# Altium schematic sheet Sh_Outputs_Analog.SchDoc
size A3
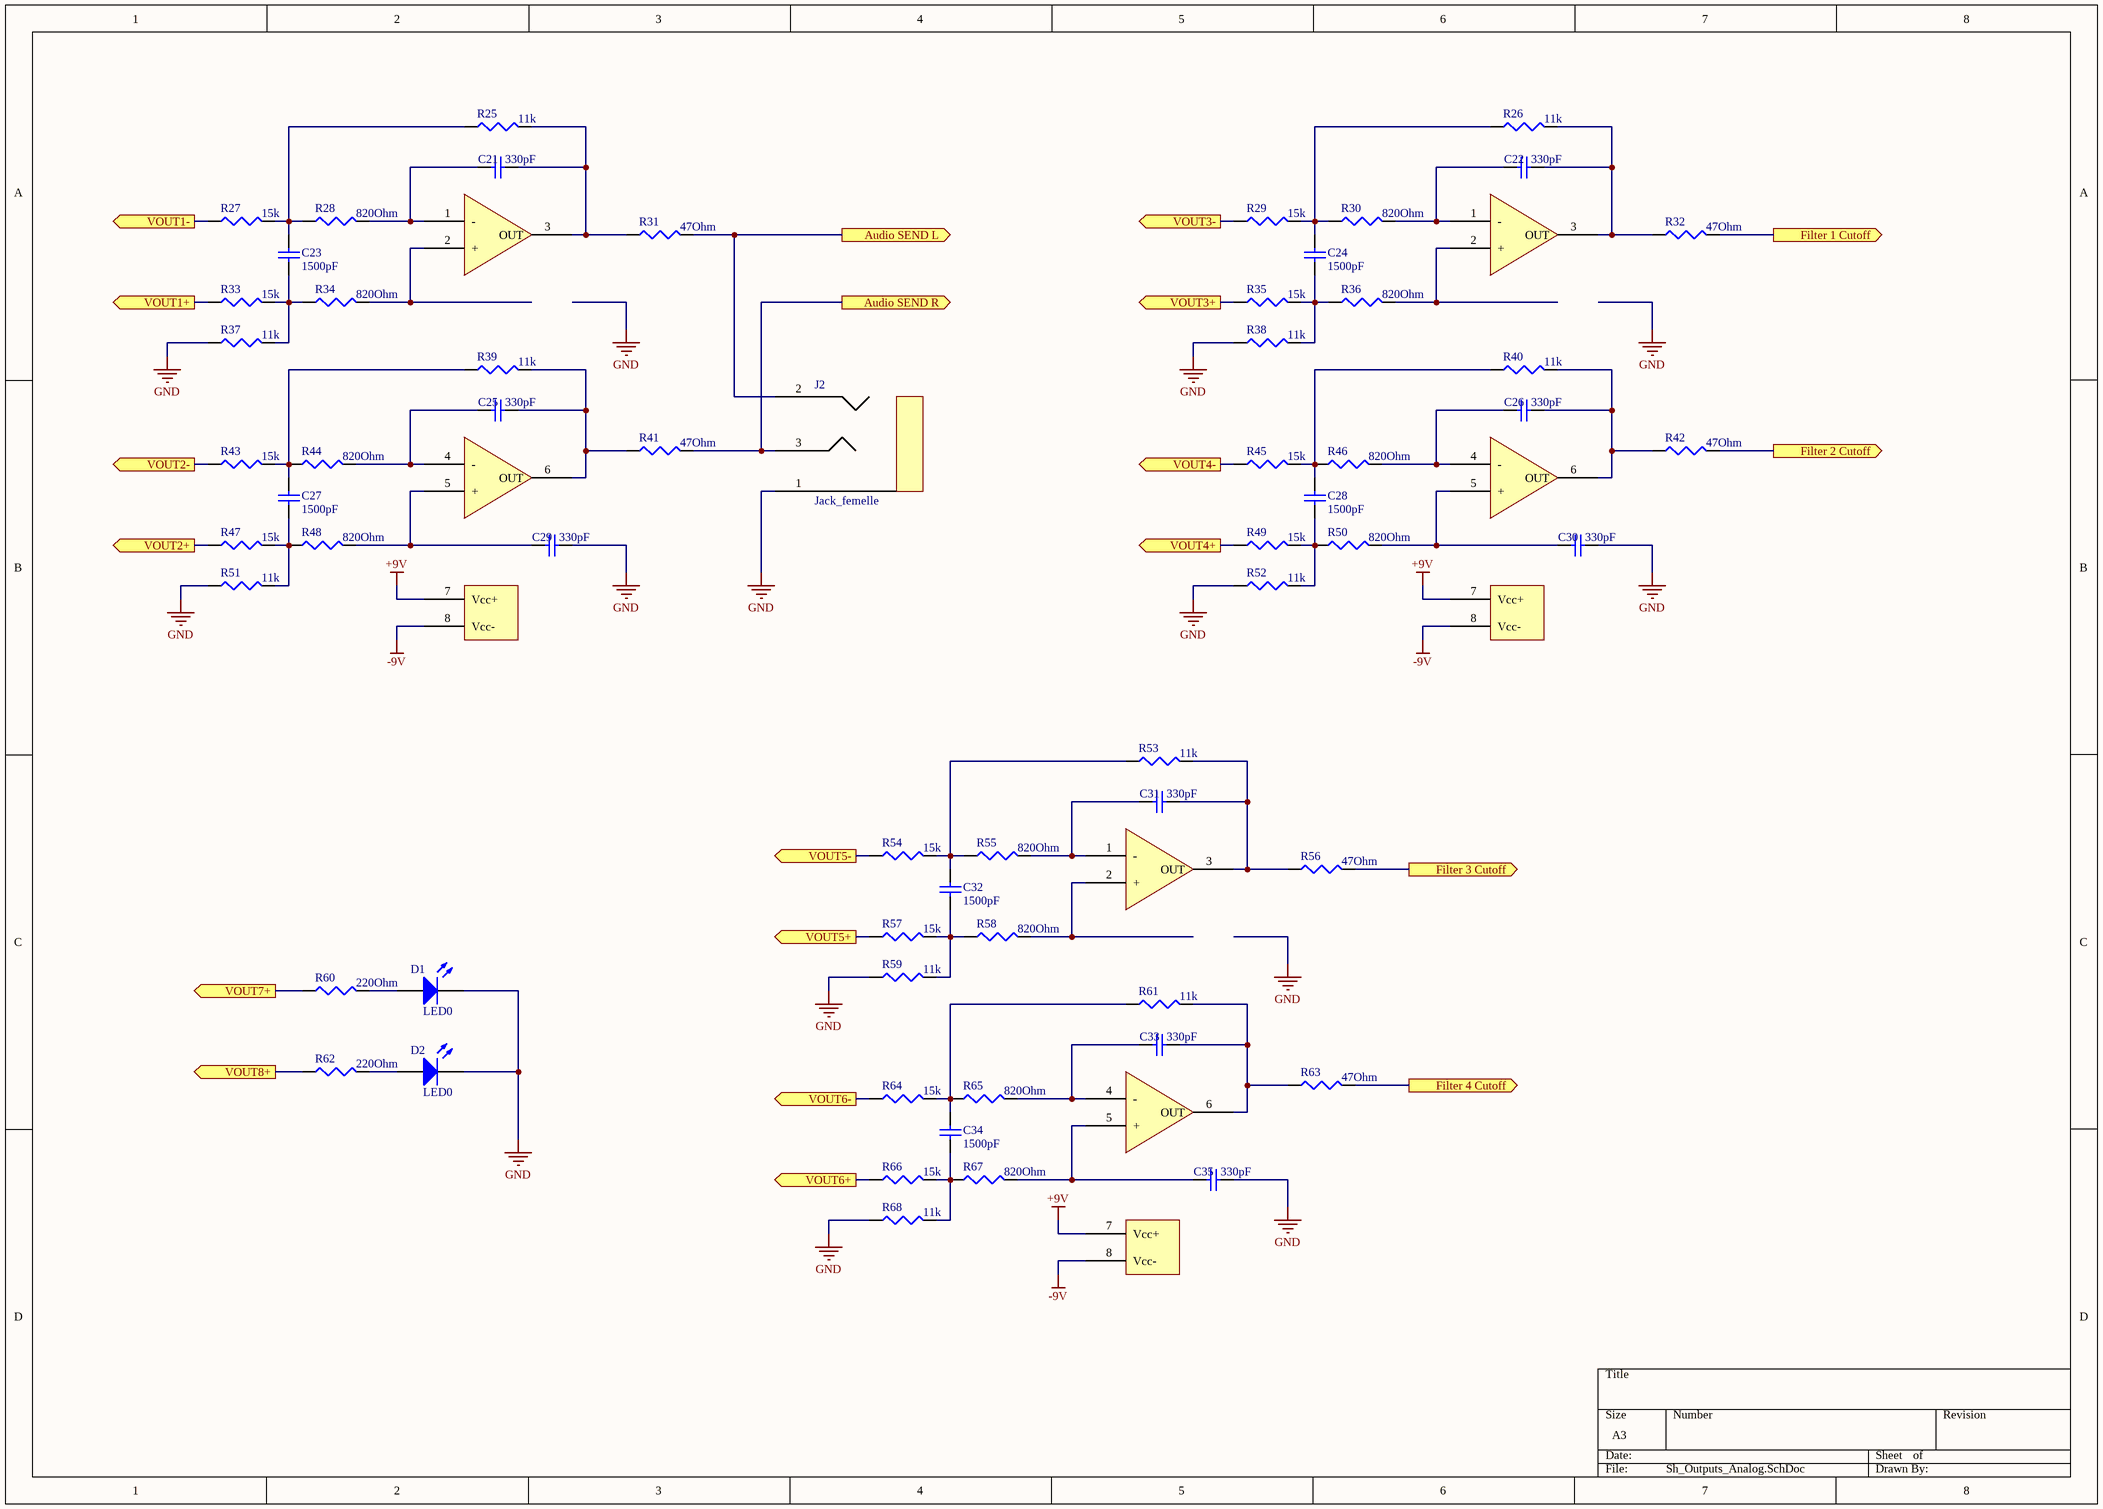
[diagram p0: Sh_Outputs_Analog.SchDoc]

## Parts
C21  value 330pF  [1608[0603]]  (hidden comment: Cap Semi)
C22  value 330pF  [1608[0603]]  (hidden comment: Cap Semi)
C23  value 1500pF  [1608[0603]]  (hidden comment: Cap Semi)
C24  value 1500pF  [1608[0603]]  (hidden comment: Cap Semi)
C25  value 330pF  [1608[0603]]  (hidden comment: Cap Semi)
C26  value 330pF  [1608[0603]]  (hidden comment: Cap Semi)
C27  value 1500pF  [1608[0603]]  (hidden comment: Cap Semi)
C28  value 1500pF  [1608[0603]]  (hidden comment: Cap Semi)
C29  value 330pF  [1608[0603]]  (hidden comment: Cap Semi)
C30  value 330pF  [1608[0603]]  (hidden comment: Cap Semi)
C31  value 330pF  [1608[0603]]  (hidden comment: Cap Semi)
C32  value 1500pF  [1608[0603]]  (hidden comment: Cap Semi)
C33  value 330pF  [1608[0603]]  (hidden comment: Cap Semi)
C34  value 1500pF  [1608[0603]]  (hidden comment: Cap Semi)
C35  value 330pF  [1608[0603]]  (hidden comment: Cap Semi)
D1  LED0  [LED-0]
D2  LED0  [LED-0]
J2  Jack_femelle  [Jack_Femelle]
R25  value 11k  [J1-0603]  (hidden comment: Res3)
R26  value 11k  [J1-0603]  (hidden comment: Res3)
R27  value 15k  [J1-0603]  (hidden comment: Res3)
R28  value 820Ohm  [J1-0603]  (hidden comment: Res3)
R29  value 15k  [J1-0603]  (hidden comment: Res3)
R30  value 820Ohm  [J1-0603]  (hidden comment: Res3)
R31  value 47Ohm  [J1-0603]  (hidden comment: Res3)
R32  value 47Ohm  [J1-0603]  (hidden comment: Res3)
R33  value 15k  [J1-0603]  (hidden comment: Res3)
R34  value 820Ohm  [J1-0603]  (hidden comment: Res3)
R35  value 15k  [J1-0603]  (hidden comment: Res3)
R36  value 820Ohm  [J1-0603]  (hidden comment: Res3)
R37  value 11k  [J1-0603]  (hidden comment: Res3)
R38  value 11k  [J1-0603]  (hidden comment: Res3)
R39  value 11k  [J1-0603]  (hidden comment: Res3)
R40  value 11k  [J1-0603]  (hidden comment: Res3)
R41  value 47Ohm  [J1-0603]  (hidden comment: Res3)
R42  value 47Ohm  [J1-0603]  (hidden comment: Res3)
R43  value 15k  [J1-0603]  (hidden comment: Res3)
R44  value 820Ohm  [J1-0603]  (hidden comment: Res3)
R45  value 15k  [J1-0603]  (hidden comment: Res3)
R46  value 820Ohm  [J1-0603]  (hidden comment: Res3)
R47  value 15k  [J1-0603]  (hidden comment: Res3)
R48  value 820Ohm  [J1-0603]  (hidden comment: Res3)
R49  value 15k  [J1-0603]  (hidden comment: Res3)
R50  value 820Ohm  [J1-0603]  (hidden comment: Res3)
R51  value 11k  [J1-0603]  (hidden comment: Res3)
R52  value 11k  [J1-0603]  (hidden comment: Res3)
R53  value 11k  [J1-0603]  (hidden comment: Res3)
R54  value 15k  [J1-0603]  (hidden comment: Res3)
R55  value 820Ohm  [J1-0603]  (hidden comment: Res3)
R56  value 47Ohm  [J1-0603]  (hidden comment: Res3)
R57  value 15k  [J1-0603]  (hidden comment: Res3)
R58  value 820Ohm  [J1-0603]  (hidden comment: Res3)
R59  value 11k  [J1-0603]  (hidden comment: Res3)
R60  value 220Ohm  [J1-0603]  (hidden comment: Res3)
R61  value 11k  [J1-0603]  (hidden comment: Res3)
R62  value 220Ohm  [J1-0603]  (hidden comment: Res3)
R63  value 47Ohm  [J1-0603]  (hidden comment: Res3)
R64  value 15k  [J1-0603]  (hidden comment: Res3)
R65  value 820Ohm  [J1-0603]  (hidden comment: Res3)
R66  value 15k  [J1-0603]  (hidden comment: Res3)
R67  value 820Ohm  [J1-0603]  (hidden comment: Res3)
R68  value 11k  [J1-0603]  (hidden comment: Res3)
U6  Ampli_op  (value not drawn)
U7  Ampli_op  (value not drawn)
U8  Ampli_op  (value not drawn)

## Ports
Audio SEND L (out), Audio SEND R (out), Filter 1 Cutoff (out), Filter 2 Cutoff (out), Filter 3 Cutoff (out), Filter 4 Cutoff (out), VOUT1+ (out), VOUT1- (out), VOUT2+ (out), VOUT2- (out), VOUT3+ (out), VOUT3- (out), VOUT4+ (out), VOUT4- (out), VOUT5+ (out), VOUT5- (out), VOUT6+ (out), VOUT6- (out), VOUT7+ (out), VOUT8+ (out)

## Nets
+9V: U6.7(Vcc+) U7.7(Vcc+) U8.7(Vcc+)
-9V: U6.8(Vcc-) U7.8(Vcc-) U8.8(Vcc-)
GND: C29.1 C30.1 C35.1 D1.2(K) D2.2(K) J2.1(GND) R37.1 R38.1 R51.1 R52.1 R59.1 R68.1
Audio SEND L: J2.2(L) R31.2 ; port Audio SEND L
Audio SEND R: J2.3(R) R41.2 ; port Audio SEND R
Filter 1 Cutoff: R32.2 ; port Filter 1 Cutoff
Filter 2 Cutoff: R42.2 ; port Filter 2 Cutoff
Filter 3 Cutoff: R56.2 ; port Filter 3 Cutoff
Filter 4 Cutoff: R63.2 ; port Filter 4 Cutoff
VOUT1+: R33.1 ; port VOUT1+
VOUT1-: R27.1 ; port VOUT1-
VOUT2+: R47.1 ; port VOUT2+
VOUT2-: R43.1 ; port VOUT2-
VOUT3+: R35.1 ; port VOUT3+
VOUT3-: R29.1 ; port VOUT3-
VOUT4+: R49.1 ; port VOUT4+
VOUT4-: R45.1 ; port VOUT4-
VOUT5+: R57.1 ; port VOUT5+
VOUT5-: R54.1 ; port VOUT5-
VOUT6+: R66.1 ; port VOUT6+
VOUT6-: R64.1 ; port VOUT6-
VOUT7+: R60.1 ; port VOUT7+
VOUT8+: R62.1 ; port VOUT8+
NetC21_1: C21.1 R25.2 R31.1 U6.3(OUT)
NetC21_2: C21.2 R28.2 U6.1(-)
NetC22_1: C22.1 R26.2 R32.1 U7.3(OUT)
NetC22_2: C22.2 R30.2 U7.1(-)
NetC23_1: C23.1 R33.2 R34.1 R37.2
NetC23_2: C23.2 R25.1 R27.2 R28.1
NetC24_1: C24.1 R35.2 R36.1 R38.2
NetC24_2: C24.2 R26.1 R29.2 R30.1
NetC25_1: C25.1 R39.2 R41.1 U6.6(OUT)
NetC25_2: C25.2 R44.2 U6.4(-)
NetC26_1: C26.1 R40.2 R42.1 U7.6(OUT)
NetC26_2: C26.2 R46.2 U7.4(-)
NetC27_1: C27.1 R47.2 R48.1 R51.2
NetC27_2: C27.2 R39.1 R43.2 R44.1
NetC28_1: C28.1 R49.2 R50.1 R52.2
NetC28_2: C28.2 R40.1 R45.2 R46.1
NetC29_2: C29.2 R48.2 U6.5(+)
NetC30_2: C30.2 R50.2 U7.5(+)
NetC31_1: C31.1 R53.2 R56.1 U8.3(OUT)
NetC31_2: C31.2 R55.2 U8.1(-)
NetC32_1: C32.1 R57.2 R58.1 R59.2
NetC32_2: C32.2 R53.1 R54.2 R55.1
NetC33_1: C33.1 R61.2 R63.1 U8.6(OUT)
NetC33_2: C33.2 R65.2 U8.4(-)
NetC34_1: C34.1 R66.2 R67.1 R68.2
NetC34_2: C34.2 R61.1 R64.2 R65.1
NetC35_2: C35.2 R67.2 U8.5(+)
NetD1_1: D1.1(A) R60.2
NetD2_1: D2.1(A) R62.2
NetR34_2: R34.2 U6.2(+)
NetR36_2: R36.2 U7.2(+)
NetR58_2: R58.2 U8.2(+)

## Library data of the parts
C21-C35 = Cap Semi: Capacitor (Semiconductor SIM Model); Published: 8-Jun-2000; LatestRevisionDate: 29-May-2009; LatestRevisionNote: IPC-7351 Footprint Added.; PackageReference: C1206; Publisher: Altium Limited; PackageDescription: Chip Capacitor
D1 D2 = LED0: Typical INFRARED GaAs LED; Published: 8-Jun-2000; LatestRevisionDate: 08-Jul-2005; LatestRevisionNote: Mech Layer 1 removed.; PackageReference: LED-0; Publisher: Altium Limited; PackageDescription: LED; 2 Leads
R25-R68 = Res3: Resistor; Published: 8-Jun-2000; LatestRevisionDate: 29-May-2009; LatestRevisionNote: IPC-7351 Footprint Added.; PackageReference: J1-0603; Publisher: Altium Limited; PackageDescription: Chip Resistor